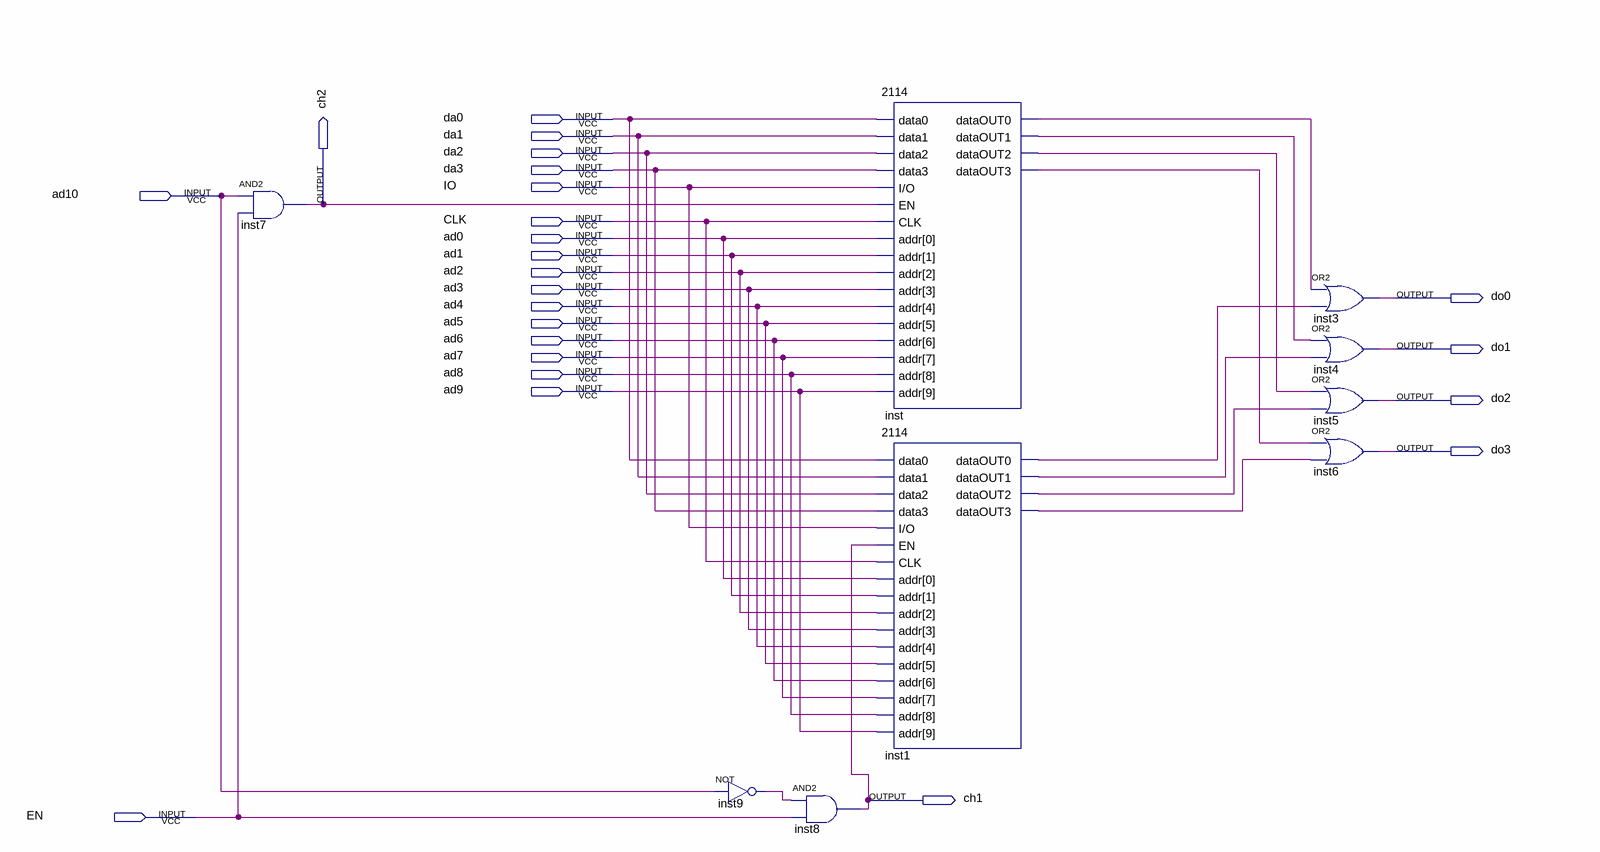
[diagram p0: schematic sheet]
// Quartus schematic COADEXP5.bdf as structural Verilog: 9 symbols, 24 pins
module COADEXP5 (
  input  da0,
  input  da1,
  input  da2,
  input  da3,
  input  IO,
  input  ad10,
  input  CLK,
  input  ad0,
  input  ad1,
  input  ad2,
  input  ad3,
  input  ad4,
  input  ad5,
  input  ad6,
  input  ad7,
  input  ad8,
  input  ad9,
  input  EN,
  output ch2,
  output do0,
  output do1,
  output do2,
  output do3,
  output ch1
);

  wire inst1_dataout0, inst1_dataout1, inst1_dataout2, inst1_dataout3, inst9_out, inst_dataout0,
       inst_dataout1, inst_dataout2, inst_dataout3;

  and inst7 (ch2, ad10, EN);
  not inst9 (inst9_out, ad10);
  and inst8 (ch1, inst9_out, EN);
  \2114  inst (
    .data0(da0), .data1(da1), .data2(da2), .data3(da3), .\I/O (IO), .EN(ch2), .CLK(CLK),
    .addr({ad9, ad8, ad7, ad6, ad5, ad4, ad3, ad2, ad1, ad0}), .dataOUT0(inst_dataout0),
    .dataOUT1(inst_dataout1), .dataOUT2(inst_dataout2), .dataOUT3(inst_dataout3));
  \2114  inst1 (
    .data0(da0), .data1(da1), .data2(da2), .data3(da3), .\I/O (IO), .EN(ch1), .CLK(CLK),
    .addr({ad9, ad8, ad7, ad6, ad5, ad4, ad3, ad2, ad1, ad0}), .dataOUT0(inst1_dataout0),
    .dataOUT1(inst1_dataout1), .dataOUT2(inst1_dataout2), .dataOUT3(inst1_dataout3));
  or inst3 (do0, inst_dataout0, inst1_dataout0);
  or inst4 (do1, inst_dataout1, inst1_dataout1);
  or inst5 (do2, inst_dataout2, inst1_dataout2);
  or inst6 (do3, inst_dataout3, inst1_dataout3);
endmodule
